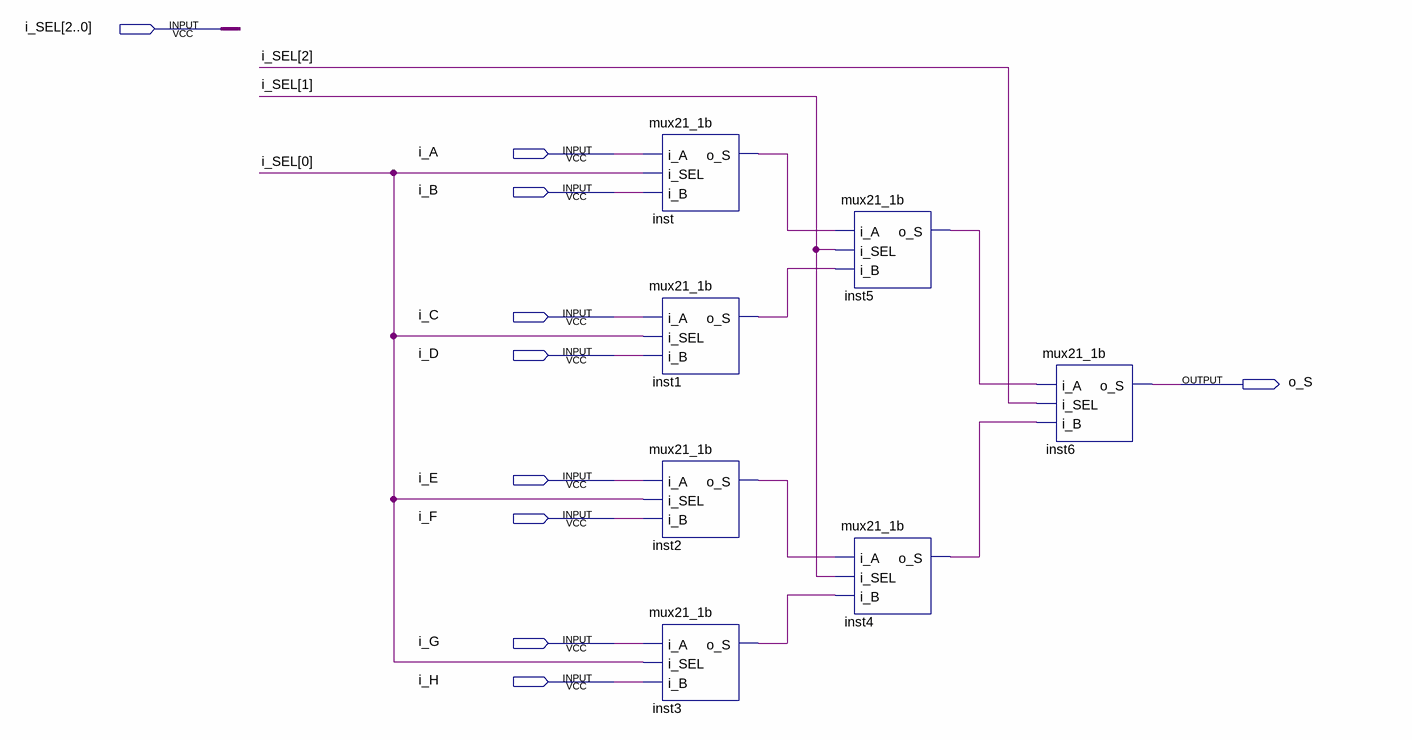
[diagram p0: schematic sheet]
// Quartus schematic mux81_1b.bdf as structural Verilog: 7 symbols, 10 pins
module mux81_1b (
  input  [2:0] i_SEL,
  input  i_A,
  input  i_B,
  input  i_C,
  input  i_D,
  input  i_E,
  input  i_F,
  input  i_G,
  input  i_H,
  output o_S
);

  wire inst1_o_s, inst2_o_s, inst3_o_s, inst4_o_s, inst5_o_s, inst_o_s;

  mux21_1b inst (.i_A(i_A), .i_SEL(i_SEL[0]), .i_B(i_B), .o_S(inst_o_s));
  mux21_1b inst1 (.i_A(i_C), .i_SEL(i_SEL[0]), .i_B(i_D), .o_S(inst1_o_s));
  mux21_1b inst2 (.i_A(i_E), .i_SEL(i_SEL[0]), .i_B(i_F), .o_S(inst2_o_s));
  mux21_1b inst3 (.i_A(i_G), .i_SEL(i_SEL[0]), .i_B(i_H), .o_S(inst3_o_s));
  mux21_1b inst5 (.i_A(inst_o_s), .i_SEL(i_SEL[1]), .i_B(inst1_o_s), .o_S(inst5_o_s));
  mux21_1b inst4 (.i_A(inst2_o_s), .i_SEL(i_SEL[1]), .i_B(inst3_o_s), .o_S(inst4_o_s));
  mux21_1b inst6 (.i_A(inst5_o_s), .i_SEL(i_SEL[2]), .i_B(inst4_o_s), .o_S(o_S));
endmodule
